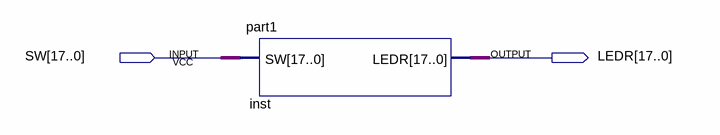
[diagram p0: schematic sheet]
// Quartus schematic Block2.bdf as structural Verilog: 1 symbols, 2 pins
module Block2 (
  input  [17:0] SW,
  output [17:0] LEDR
);

  part1 inst (.SW(SW), .LEDR(LEDR));
endmodule
